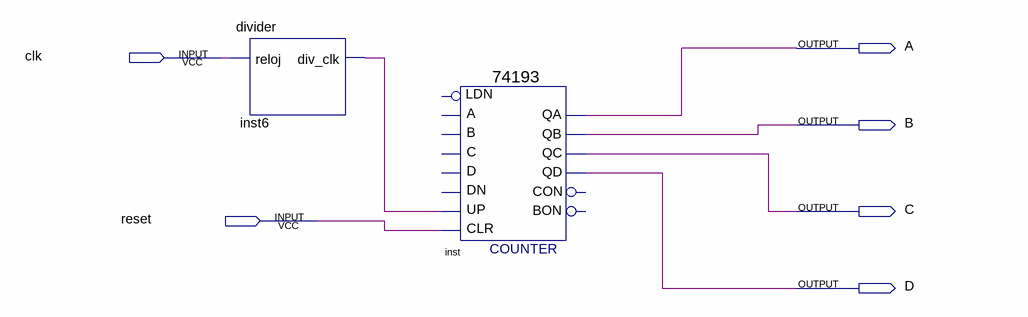
[diagram p0: schematic sheet]
// Quartus schematic Practica1.bdf as structural Verilog: 2 symbols, 6 pins
module Practica1 (
  input  clk,
  input  reset,
  output A,
  output B,
  output C,
  output D
);

  wire inst6_div_clk;

  divider inst6 (.reloj(clk), .div_clk(inst6_div_clk));
  \74193  inst (
    .CLR(reset), .UP(inst6_div_clk), .QB(B), .QA(A), .QD(D), .QC(C));  // open: D, C, B, A, DN, LDN, CON, BON
endmodule
